# Altium schematic sheet RTM_Connector.SchDoc: RFSoC AMC
size 420 x 297 mm; CompanyName: WUT; DrawnBy: T. Przywozki; Organization: WUT ISE; Address1: Warsaw University of Technology; Address2: Nowowiejska 15/19 00-665 Warsaw; Address3: Tomasz.Przywozki@pw.edu.pl; DocumentNumber: 26; Revision: 1; SheetNumber: 26; SheetTotal: 45; Project: RFSoC AMC; ModifiedBy: T. Przywozki; CreateDate: -; CheckedDate: -; DivGrp: ISE; Designer: T. Przywozki; ModifiedDate: -; ProjectName: ADC/DAC MEZZANINE
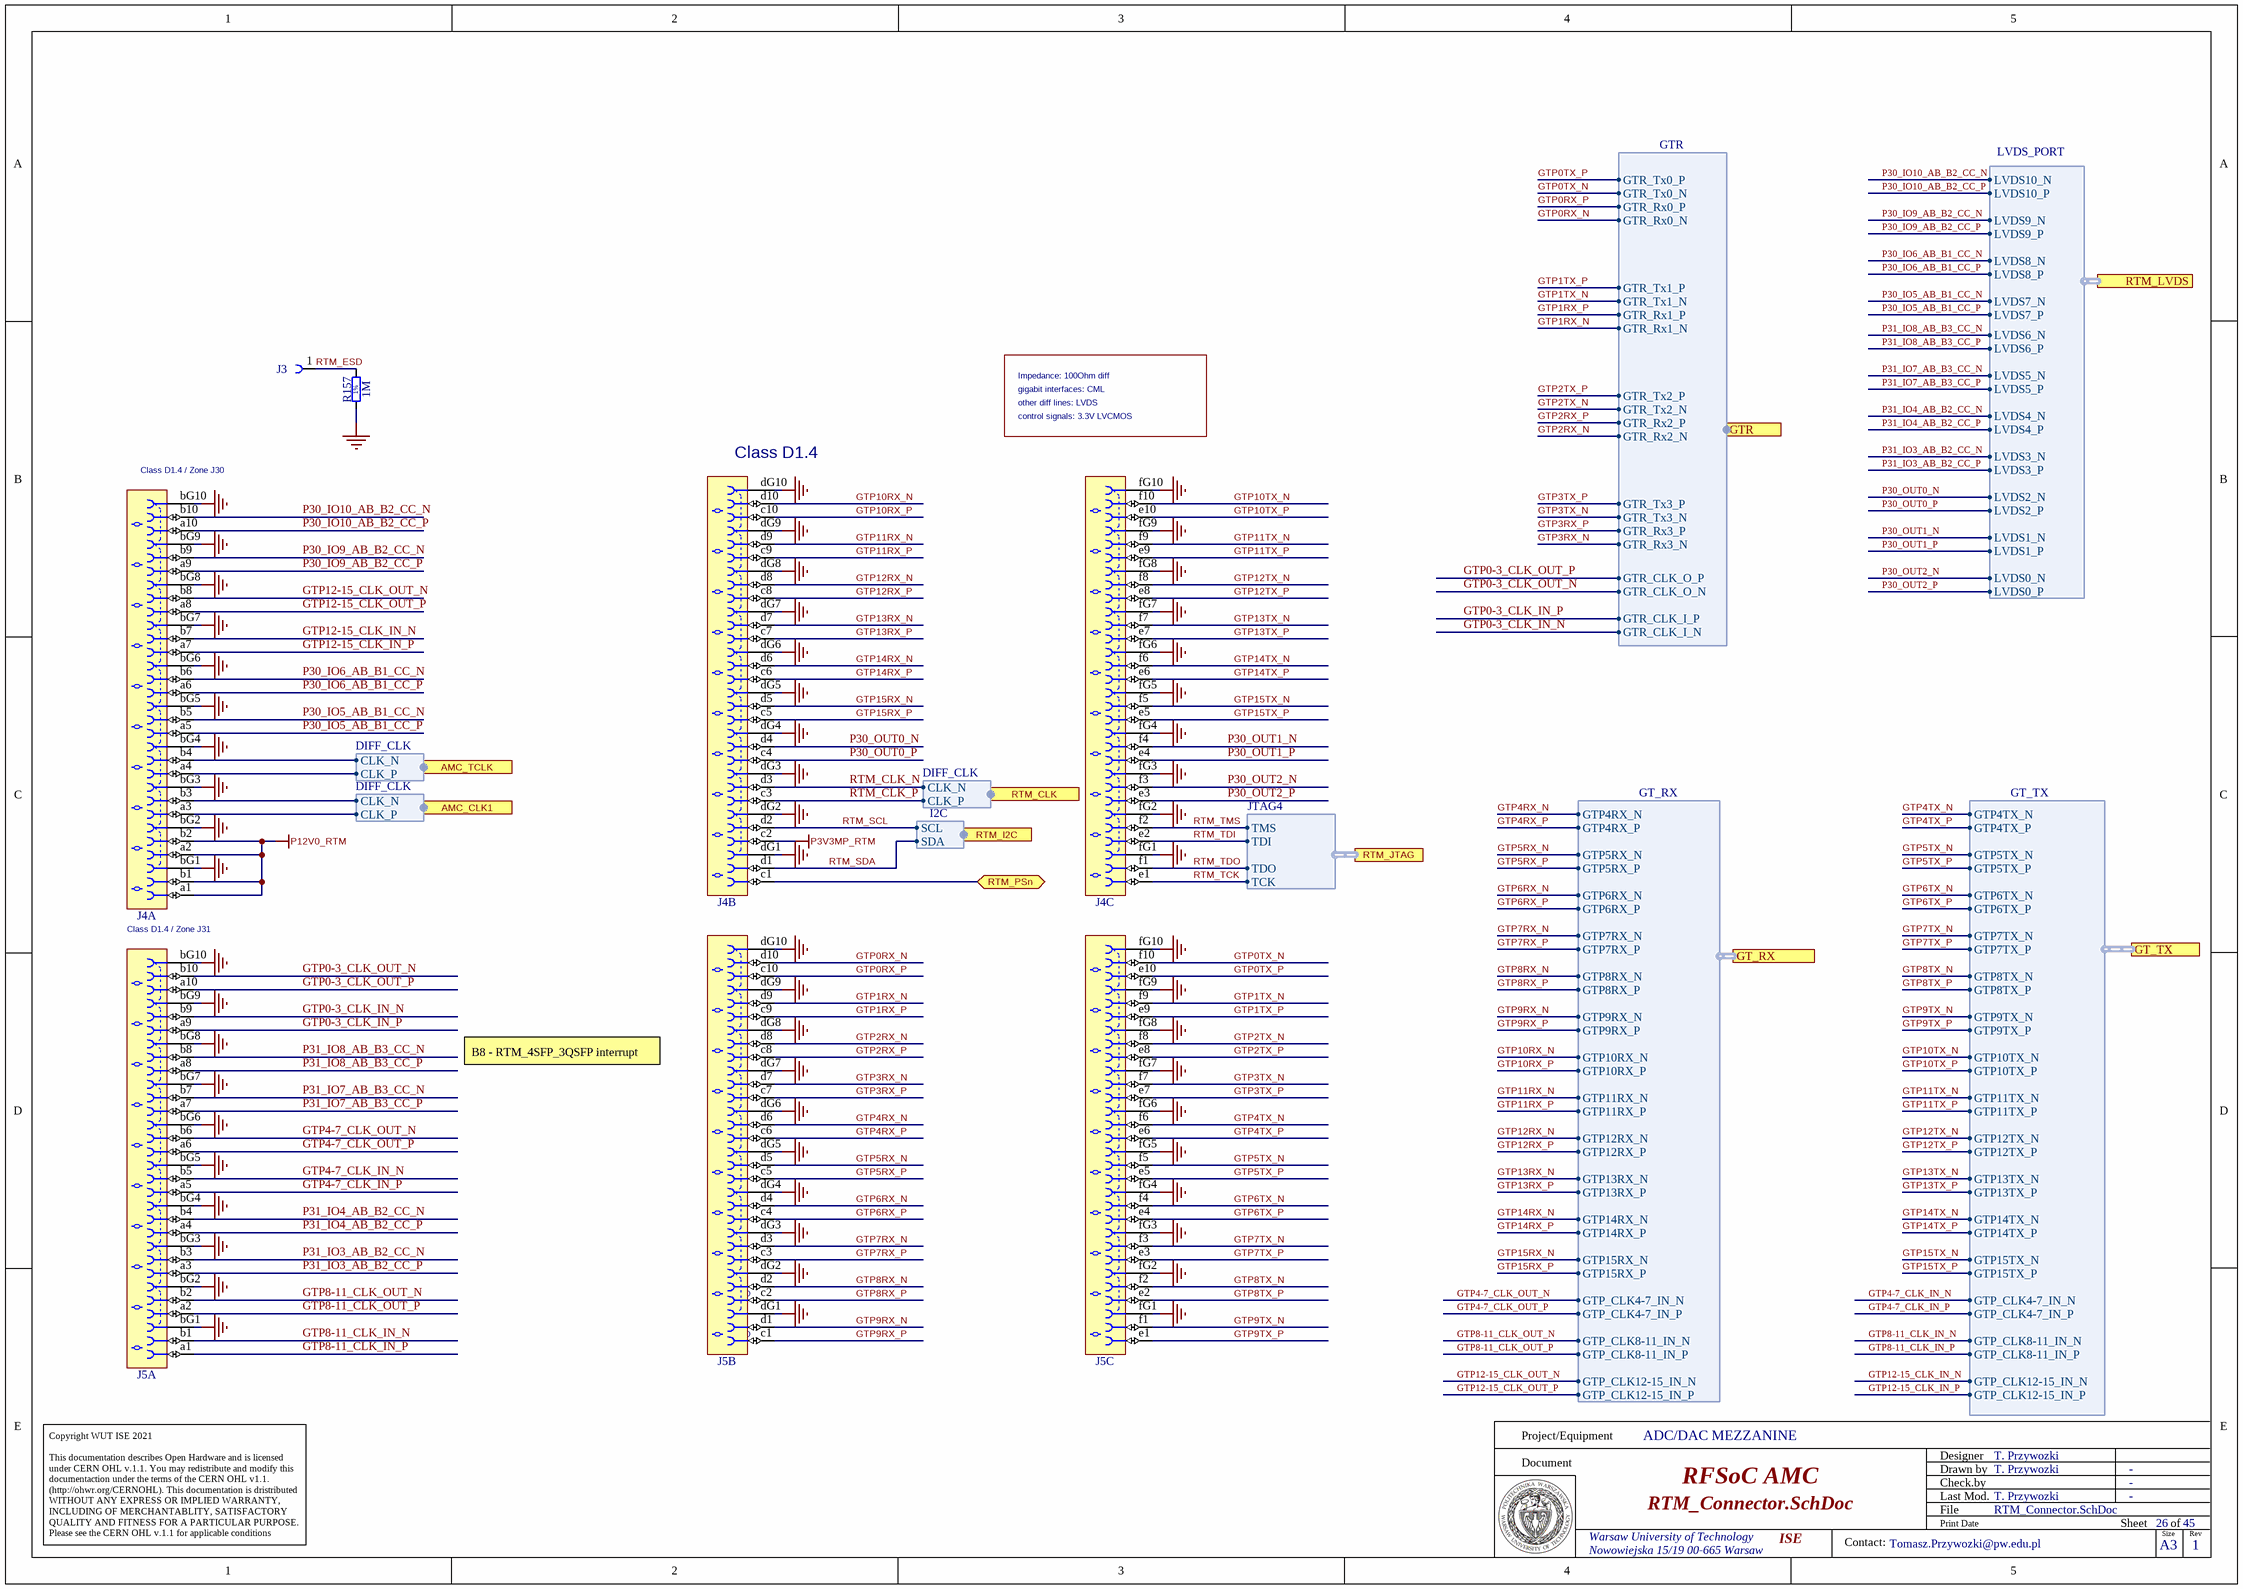
[diagram p0: RTM_Connector.SchDoc]

## Parts
J3  (no value)  [TYCO_5120913-1]
J4  Advanced TCA  [TYCO_6469081-1]  (value not drawn)  (parts A,B,C of 3)
J5  Advanced TCA  [TYCO_6469081-1]  (value not drawn)  (parts A,B,C of 3)
R157  1M  [RESC5025X65N]

## Ports
AMC_CLK1 (harness DIFF_CLK), AMC_TCLK (harness DIFF_CLK), GT_RX (harness GT_RX), GT_TX (harness GT_TX), GTR (harness GTR), RTM_CLK (harness DIFF_CLK), RTM_I2C (harness I2C), RTM_JTAG (harness JTAG4), RTM_LVDS (harness LVDS_PORT), RTM_PSn (bidir)

## Harnesses
LVDS_PORT: LVDS0_P, LVDS0_N, LVDS1_P, LVDS1_N, LVDS2_P, LVDS2_N, LVDS3_P, LVDS3_N, LVDS4_P, LVDS4_N, LVDS5_P, LVDS5_N, LVDS6_P, LVDS6_N, LVDS7_P, LVDS7_N, LVDS8_P, LVDS8_N, LVDS9_P, LVDS9_N, LVDS10_P, LVDS10_N
GT_RX: GTP4RX_P, GTP5RX_N, GTP4RX_N, GTP5RX_P, GTP6RX_N, GTP6RX_P, GTP7RX_N, GTP7RX_P, GTP8RX_N, GTP8RX_P, GTP9RX_N, GTP9RX_P, GTP10RX_N, GTP10RX_P, GTP11RX_N, GTP11RX_P, GTP12RX_N, GTP12RX_P, GTP13RX_N, GTP13RX_P, GTP14RX_N, GTP14RX_P, GTP15RX_N, GTP15RX_P, GTP_CLK4-7_IN_N, GTP_CLK8-11_IN_N, GTP_CLK4-7_IN_P, GTP_CLK8-11_IN_P, GTP_CLK12-15_IN_N, GTP_CLK12-15_IN_P
GT_TX: GTP4TX_N, GTP4TX_P, GTP5TX_N, GTP5TX_P, GTP6TX_N, GTP6TX_P, GTP7TX_N, GTP7TX_P, GTP8TX_N, GTP8TX_P, GTP9TX_N, GTP9TX_P, GTP10TX_N, GTP10TX_P, GTP11TX_N, GTP11TX_P, GTP12TX_N, GTP12TX_P, GTP13TX_N, GTP13TX_P, GTP14TX_N, GTP14TX_P, GTP15TX_N, GTP15TX_P, GTP_CLK4-7_IN_N, GTP_CLK8-11_IN_N, GTP_CLK4-7_IN_P, GTP_CLK8-11_IN_P, GTP_CLK12-15_IN_N, GTP_CLK12-15_IN_P
JTAG4: TMS, TDI, TDO, TCK
I2C: SCL, SDA
DIFF_CLK: CLK_P, CLK_N
GTR: GTR_Tx0_P, GTR_Tx0_N, GTR_Rx0_P, GTR_Rx0_N, GTR_Rx1_P, GTR_Rx1_N, GTR_Tx1_P, GTR_Tx1_N, GTR_Rx2_P, GTR_Rx2_N, GTR_Tx2_P, GTR_Tx2_N, GTR_Rx3_P, GTR_Rx3_N, GTR_Tx3_P, GTR_Tx3_N, GTR_CLK_O_P, GTR_CLK_O_N, GTR_CLK_I_P, GTR_CLK_I_N

## Nets
GND: J4.bG1 J4.bG2 J4.bG3 J4.bG4 J4.bG5 J4.bG6 J4.bG7 J4.bG8 J4.bG9 J4.bG10 J4.dG1 J4.dG2 J4.dG3 J4.dG4 J4.dG5 J4.dG6 J4.dG7 J4.dG8 J4.dG9 J4.dG10 J4.fG1 J4.fG2 J4.fG3 J4.fG4 J4.fG5 J4.fG6 J4.fG7 J4.fG8 J4.fG9 J4.fG10 J5.bG1 J5.bG2 J5.bG3 J5.bG4 J5.bG5 J5.bG6 J5.bG7 J5.bG8 J5.bG9 J5.bG10 J5.dG1 J5.dG2 J5.dG3 J5.dG4 J5.dG5 J5.dG6 J5.dG7 J5.dG8 J5.dG9 J5.dG10 J5.fG1 J5.fG2 J5.fG3 J5.fG4 J5.fG5 J5.fG6 J5.fG7 J5.fG8 J5.fG9 J5.fG10 R157.1
P3V3MP_RTM: J4.c2
P12V0_RTM: J4.a1 J4.a2 J4.b1 J4.b2
GTP0-3_CLK_IN_N: J5.b9 ; port GTR.GTR_CLK_I_N
GTP0-3_CLK_IN_P: J5.a9 ; port GTR.GTR_CLK_I_P
GTP0-3_CLK_OUT_N: J5.b10 ; port GTR.GTR_CLK_O_N
GTP0-3_CLK_OUT_P: J5.a10 ; port GTR.GTR_CLK_O_P
GTP0RX_N: J5.d10 ; port GTR.GTR_Rx0_N
GTP0RX_P: J5.c10 ; port GTR.GTR_Rx0_P
GTP0TX_N: J5.f10 ; port GTR.GTR_Tx0_N
GTP0TX_P: J5.e10 ; port GTR.GTR_Tx0_P
GTP1RX_N: J5.d9 ; port GTR.GTR_Rx1_N
GTP1RX_P: J5.c9 ; port GTR.GTR_Rx1_P
GTP1TX_N: J5.f9 ; port GTR.GTR_Tx1_N
GTP1TX_P: J5.e9 ; port GTR.GTR_Tx1_P
GTP2RX_N: J5.d8 ; port GTR.GTR_Rx2_N
GTP2RX_P: J5.c8 ; port GTR.GTR_Rx2_P
GTP2TX_N: J5.f8 ; port GTR.GTR_Tx2_N
GTP2TX_P: J5.e8 ; port GTR.GTR_Tx2_P
GTP3RX_N: J5.d7 ; port GTR.GTR_Rx3_N
GTP3RX_P: J5.c7 ; port GTR.GTR_Rx3_P
GTP3TX_N: J5.f7 ; port GTR.GTR_Tx3_N
GTP3TX_P: J5.e7 ; port GTR.GTR_Tx3_P
GTP4-7_CLK_IN_N: J5.b5 ; port GT_TX.GTP_CLK4-7_IN_N
GTP4-7_CLK_IN_P: J5.a5 ; port GT_TX.GTP_CLK4-7_IN_P
GTP4-7_CLK_OUT_N: J5.b6 ; port GT_RX.GTP_CLK4-7_IN_N
GTP4-7_CLK_OUT_P: J5.a6 ; port GT_RX.GTP_CLK4-7_IN_P
GTP4RX_N: J5.d6 ; port GT_RX.GTP4RX_N
GTP4RX_P: J5.c6 ; port GT_RX.GTP4RX_P
GTP4TX_N: J5.f6 ; port GT_TX.GTP4TX_N
GTP4TX_P: J5.e6 ; port GT_TX.GTP4TX_P
GTP5RX_N: J5.d5 ; port GT_RX.GTP5RX_N
GTP5RX_P: J5.c5 ; port GT_RX.GTP5RX_P
GTP5TX_N: J5.f5 ; port GT_TX.GTP5TX_N
GTP5TX_P: J5.e5 ; port GT_TX.GTP5TX_P
GTP6RX_N: J5.d4 ; port GT_RX.GTP6RX_N
GTP6RX_P: J5.c4 ; port GT_RX.GTP6RX_P
GTP6TX_N: J5.f4 ; port GT_TX.GTP6TX_N
GTP6TX_P: J5.e4 ; port GT_TX.GTP6TX_P
GTP7RX_N: J5.d3 ; port GT_RX.GTP7RX_N
GTP7RX_P: J5.c3 ; port GT_RX.GTP7RX_P
GTP7TX_N: J5.f3 ; port GT_TX.GTP7TX_N
GTP7TX_P: J5.e3 ; port GT_TX.GTP7TX_P
GTP8-11_CLK_IN_N: J5.b1 ; port GT_TX.GTP_CLK8-11_IN_N
GTP8-11_CLK_IN_P: J5.a1 ; port GT_TX.GTP_CLK8-11_IN_P
GTP8-11_CLK_OUT_N: J5.b2 ; port GT_RX.GTP_CLK8-11_IN_N
GTP8-11_CLK_OUT_P: J5.a2 ; port GT_RX.GTP_CLK8-11_IN_P
GTP8RX_N: J5.d2 ; port GT_RX.GTP8RX_N
GTP8RX_P: J5.c2 ; port GT_RX.GTP8RX_P
GTP8TX_N: J5.f2 ; port GT_TX.GTP8TX_N
GTP8TX_P: J5.e2 ; port GT_TX.GTP8TX_P
GTP9RX_N: J5.d1 ; port GT_RX.GTP9RX_N
GTP9RX_P: J5.c1 ; port GT_RX.GTP9RX_P
GTP9TX_N: J5.f1 ; port GT_TX.GTP9TX_N
GTP9TX_P: J5.e1 ; port GT_TX.GTP9TX_P
GTP10RX_N: J4.d10 ; port GT_RX.GTP10RX_N
GTP10RX_P: J4.c10 ; port GT_RX.GTP10RX_P
GTP10TX_N: J4.f10 ; port GT_TX.GTP10TX_N
GTP10TX_P: J4.e10 ; port GT_TX.GTP10TX_P
GTP11RX_N: J4.d9 ; port GT_RX.GTP11RX_N
GTP11RX_P: J4.c9 ; port GT_RX.GTP11RX_P
GTP11TX_N: J4.f9 ; port GT_TX.GTP11TX_N
GTP11TX_P: J4.e9 ; port GT_TX.GTP11TX_P
GTP12-15_CLK_IN_N: J4.b7 ; port GT_TX.GTP_CLK12-15_IN_N
GTP12-15_CLK_IN_P: J4.a7 ; port GT_TX.GTP_CLK12-15_IN_P
GTP12-15_CLK_OUT_N: J4.b8 ; port GT_RX.GTP_CLK12-15_IN_N
GTP12-15_CLK_OUT_P: J4.a8 ; port GT_RX.GTP_CLK12-15_IN_P
GTP12RX_N: J4.d8 ; port GT_RX.GTP12RX_N
GTP12RX_P: J4.c8 ; port GT_RX.GTP12RX_P
GTP12TX_N: J4.f8 ; port GT_TX.GTP12TX_N
GTP12TX_P: J4.e8 ; port GT_TX.GTP12TX_P
GTP13RX_N: J4.d7 ; port GT_RX.GTP13RX_N
GTP13RX_P: J4.c7 ; port GT_RX.GTP13RX_P
GTP13TX_N: J4.f7 ; port GT_TX.GTP13TX_N
GTP13TX_P: J4.e7 ; port GT_TX.GTP13TX_P
GTP14RX_N: J4.d6 ; port GT_RX.GTP14RX_N
GTP14RX_P: J4.c6 ; port GT_RX.GTP14RX_P
GTP14TX_N: J4.f6 ; port GT_TX.GTP14TX_N
GTP14TX_P: J4.e6 ; port GT_TX.GTP14TX_P
GTP15RX_N: J4.d5 ; port GT_RX.GTP15RX_N
GTP15RX_P: J4.c5 ; port GT_RX.GTP15RX_P
GTP15TX_N: J4.f5 ; port GT_TX.GTP15TX_N
GTP15TX_P: J4.e5 ; port GT_TX.GTP15TX_P
P30_IO5_AB_B1_CC_N: J4.b5 ; port RTM_LVDS.LVDS7_N
P30_IO5_AB_B1_CC_P: J4.a5 ; port RTM_LVDS.LVDS7_P
P30_IO6_AB_B1_CC_N: J4.b6 ; port RTM_LVDS.LVDS8_N
P30_IO6_AB_B1_CC_P: J4.a6 ; port RTM_LVDS.LVDS8_P
P30_IO9_AB_B2_CC_N: J4.b9 ; port RTM_LVDS.LVDS9_N
P30_IO9_AB_B2_CC_P: J4.a9 ; port RTM_LVDS.LVDS9_P
P30_IO10_AB_B2_CC_N: J4.b10 ; port RTM_LVDS.LVDS10_N
P30_IO10_AB_B2_CC_P: J4.a10 ; port RTM_LVDS.LVDS10_P
P30_OUT0_N: J4.d4 ; port RTM_LVDS.LVDS2_N
P30_OUT0_P: J4.c4 ; port RTM_LVDS.LVDS2_P
P30_OUT1_N: J4.f4 ; port RTM_LVDS.LVDS1_N
P30_OUT1_P: J4.e4 ; port RTM_LVDS.LVDS1_P
P30_OUT2_N: J4.f3 ; port RTM_LVDS.LVDS0_N
P30_OUT2_P: J4.e3 ; port RTM_LVDS.LVDS0_P
P31_IO3_AB_B2_CC_N: J5.b3 ; port RTM_LVDS.LVDS3_N
P31_IO3_AB_B2_CC_P: J5.a3 ; port RTM_LVDS.LVDS3_P
P31_IO4_AB_B2_CC_N: J5.b4 ; port RTM_LVDS.LVDS4_N
P31_IO4_AB_B2_CC_P: J5.a4 ; port RTM_LVDS.LVDS4_P
P31_IO7_AB_B3_CC_N: J5.b7 ; port RTM_LVDS.LVDS5_N
P31_IO7_AB_B3_CC_P: J5.a7 ; port RTM_LVDS.LVDS5_P
P31_IO8_AB_B3_CC_N: J5.b8 ; port RTM_LVDS.LVDS6_N
P31_IO8_AB_B3_CC_P: J5.a8 ; port RTM_LVDS.LVDS6_P
RTM_CLK_N: J4.d3 ; port RTM_CLK.CLK_N
RTM_CLK_P: J4.c3 ; port RTM_CLK.CLK_P
RTM_ESD: J3.1 R157.2
RTM_PSn: J4.c1 ; port RTM_PSn
RTM_SCL: J4.d2 ; port RTM_I2C.SCL
RTM_SDA: J4.d1 ; port RTM_I2C.SDA
RTM_TCK: J4.e1 ; port RTM_JTAG.TCK
RTM_TDI: J4.e2 ; port RTM_JTAG.TDI
RTM_TDO: J4.f1 ; port RTM_JTAG.TDO
RTM_TMS: J4.f2 ; port RTM_JTAG.TMS
NetJ4_a3: J4.a3 ; port AMC_CLK1.CLK_P
NetJ4_a4: J4.a4 ; port AMC_TCLK.CLK_P
NetJ4_b3: J4.b3 ; port AMC_CLK1.CLK_N
NetJ4_b4: J4.b4 ; port AMC_TCLK.CLK_N

## Notes on the sheet
- gigabit interfaces: CML
- Impedance: 100Ohm diff
- (near J4) Class D1.4
- other diff lines: LVDS
- control signals: 3.3V LVCMOS
- (near J4) Class D1.4 / Zone J30
- Class D1.4 / Zone J31
- B8 - RTM_4SFP_3QSFP interrupt
- (near J5) NOT USED
- Project/Equipment
- Document
- Designer
- Drawn by
- Check.by
- Copyright WUT ISE 2021
  This documentation describes Open Hardware and is licensed under CERN OHL v.1.1. You may redistribute and modify this documentaction under the terms of the CERN OHL v1.1.
  (http://ohwr.org/CERNOHL). This documentation is dristributed WITHOUT ANY EXPRESS OR IMPLIED WARRANTY, INCLUDING OF MERCHANTABLITY, SATISFACTORY QUALITY AND FITNESS FOR A PARTICULAR PURPOSE. Please see the CERN OHL v.1.1 for applicable conditions
- File
- Last Mod.
- Print Date
- Sheet
- Size
- A3
- of
- Rev
- Contact:
- (in symbol R2010_1M_1%_0.5W_200PPM) 1%

## Library data of the parts
J3 = TYCO_5120913-1: Single Pin Female; Manufacturer: TYCO ELECTRONICS; Part Description: Universal Right Angle Female Power Module Guide (keyed); PressFit: No; Manufacturer Part Number: 5120913-1; Part Number: TYCO_5120913-1; Component Kind: Standard; Component Type: Standard; Pin Count: 1; Mounted: Yes; Socket: No; SMD: No; Sense: No; Status: None; ComponentHeight: 9.78mm; HelpURL: \\cern.ch\dfs\Applications\Altium\Datasheets\TYCO_5120913-1.pdf; Author: CERN DEM JLC; CreateDate: 28/08/2013; LatestRevisionDate: 28/08/2013
J4 J5 = TYCO_6469081-1: Connector 60 ATCA Female 30 Pairs (60 Signals) + 3x10 Ground; Manufacturer: TYCO ELECTRONICS; Part Description: 60 Positions, Pitch 2.5mm,  Advanced TCA, Z-PACK HM-Zd Right Angle Press Fit Receptacle; Manufacturer Part Number: 6469081-1; Part Number: TYCO_6469081-1; Component Kind: Standard; Component Type: Standard; Pin Count: 90; Family: Advanced TCA; Mounted: Yes; Socket: No; SMD: No; PressFit: Yes; Sense: No; Status: None; ComponentHeight: 12.18mm; HelpURL: \\cern.ch\dfs\Applications\Altium\Datasheets\TYCO_6469081-1.pdf; Author: CERN DEM JLC; CreateDate: 28/08/2013; LatestRevisionDate: 28/08/2013
R157 = R2010_1M_1%_0.5W_200PPM: Resistor - 1%; Manufacturer: GENERIC; Part Description: Thick Film Chip Resistor; Manufacturer1 Part Number: LHVC2010-1MFT4; Power: 0.5W; TC: ±200ppm/°C; PressFit: No; Manufacturer Part Number: R2010_1M_1%_0.5W_200PPM; Part Number: R2010_1M_1%_0.5W_200PPM; Tolerance: ±1%; Value: 1M; Component Kind: Standard; Component Type: Standard; Pin Count: 2; Status: None; Case: 2010; Mounted: Yes; Sense: No; Socket: No; SMD: Yes; Manufacturer1 Example: TT WELWYN; Manufacturer1 ComponentHeight: 0.65mm; HelpURL: \\cern.ch\dfs\Applications\Altium\Datasheets\R2010_WELWYN_LHVC.pdf; Author: CERN DEM JLC; CreateDate: 26/02/2015; LatestRevisionDate: 26/02/2015